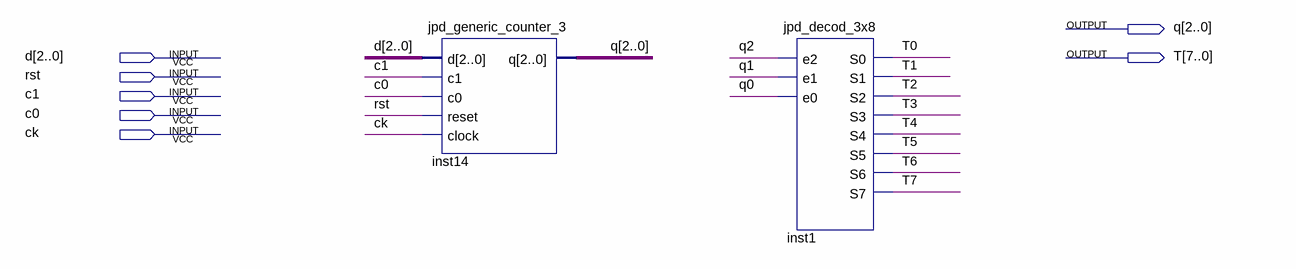
[diagram p0: schematic sheet]
// Quartus schematic jpd_counter.bdf as structural Verilog: 2 symbols, 7 pins
module jpd_counter (
  input  [2:0] d,
  input  rst,
  input  c1,
  input  c0,
  input  ck,
  output [2:0] q,
  output [7:0] T
);

  jpd_generic_counter_3 inst14 (.d(d), .c1(c1), .c0(c0), .reset(rst), .clock(ck), .q(q));
  jpd_decod_3x8 inst1 (
    .e2(q[2]), .e1(q[1]), .e0(q[0]), .S0(T[0]), .S1(T[1]), .S2(T[2]), .S3(T[3]), .S4(T[4]), .S5(T[5]),
    .S6(T[6]), .S7(T[7]));
endmodule
